# Altium schematic sheet CAN_IFC.SchDoc
size A4
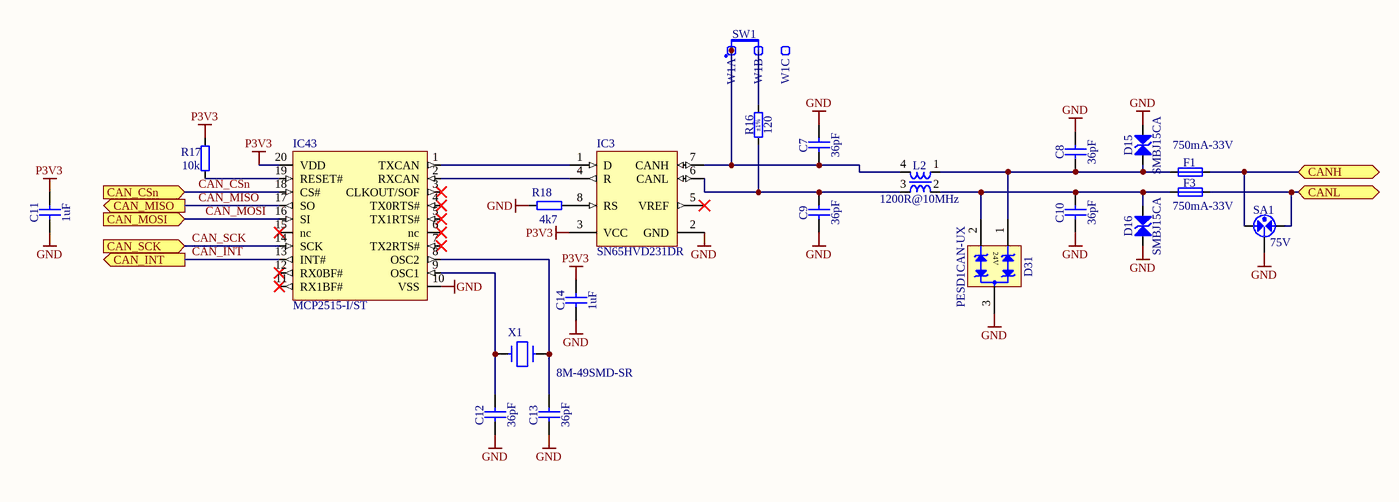
[diagram p0: CAN_IFC.SchDoc]

## Parts
C7  36pF  [CAPC1608X87N]
C8  36pF  [CAPC1608X87N]
C9  36pF  [CAPC1608X87N]
C10  36pF  [CAPC1608X87N]
C11  1uF  [CAPC1608X87N]
C12  36pF  [CAPC1608X87N]
C13  36pF  [CAPC1608X87N]
C14  1uF  [CAPC1608X87N]
D15  SMBJ15CA  [DIOM5336X265N]
D16  SMBJ15CA  [DIOM5336X265N]
D31  PESD1CAN-UX  [SOT95P237X112-3N]
F1  750mA-33V  [FUSRC4632X150N]
F3  750mA-33V  [FUSRC4632X150N]
IC3  SN65HVD231DR  [D0008A_L]
IC43  MCP2515-I/ST  [SOP65P640X110-20N]
L2  1200R@10MHz  [IND_TDK_ACT45B]
R16  120  Tolerance: ±1%  [RESC3216X65N]
R17  10k  [RESC1608X55N]
R18  4k7  [RESC1608X55N]
SA1  75V  [SAR_BOURNS_2036-xx-SM]
SW1  Jumper Type1  [JUMPER_BLACK_INSULATED_2.54MM]  (value not drawn)
W1  Test Point  [COMATEL_385.0358.1.03.400]  (value not drawn)  (parts A,B,C of 3)
X1  8M-49SMD-SR  [HC-49SM]

## Ports
CAN_CSn (in), CAN_INT (out), CAN_MISO (out), CAN_MOSI (in), CAN_SCK (in), CANH (bidir), CANL (bidir)

## Nets
GND: C7.2 C8.2 C9.1 C10.1 C11.1 C12.1 C13.1 C14.1 D15.2 D16.1 D31.3(GND) IC3.2(GND) IC43.10(VSS) R18.2 SA1.3
P3V3: C11.2 C14.2 IC3.3(VCC) IC43.20(VDD) R17.2
CAN_CSn: IC43.18(CS#) ; port CAN_CSn
CAN_INT: IC43.13(INT#) ; port CAN_INT
CAN_MISO: IC43.17(SO) ; port CAN_MISO
CAN_MOSI: IC43.16(SI) ; port CAN_MOSI
CAN_SCK: IC43.14(SCK) ; port CAN_SCK
CANH: F1.2 SA1.1 ; port CANH
CANL: F3.2 SA1.2 ; port CANL
NetC7_1: C7.1 IC3.7(CANH) L2.4 SW1.1 W1.1
NetC8_1: C8.1 D15.1 D31.1(I/O1) F1.1 L2.1
NetC9_2: C9.2 IC3.6(CANL) L2.3 R16.1
NetC10_2: C10.2 D16.2 D31.2(I/O2) F3.1 L2.2
NetC12_2: C12.2 IC43.9(OSC1) X1.1
NetC13_2: C13.2 IC43.8(OSC2) X1.2
NetIC3_1: IC3.1(D) IC43.1(TXCAN)
NetIC3_4: IC3.4(R) IC43.2(RXCAN)
NetIC3_8: IC3.8(RS) R18.1
NetIC43_19: IC43.19(RESET#) R17.1
NetR16_2: R16.2 W1.2

Not connected (* = marked no-connect by the designer): IC3 5(VREF)*; IC43 3(CLKOUT/SOF)* 4(TX0RTS#)* 5(TX1RTS#)* 6(nc)* 7(TX2RTS#)* 11(RX1BF#)* 12(RX0BF#)* 15(nc)*; W1 3

## Library data of the parts
C7-C10 C12 C13 = CC0603_36PF_50V_5%_C0G: Non-polarised capacitor; Part Description: SMD Multilayer Chip Ceramic Capacitor; Manufacturer: GENERIC; Manufacturer1 Part Number: CBR06C360J5GACAUTO; Voltage: 50V; TC: C0G/NP0; Tolerance: ±5%; Part Number: CC0603_36PF_50V_5%_C0G; Component Kind: Standard; Component Type: Standard; Pin Count: 2; Value: 36pF; Status: Preferred; Manufacturer Part Number: CC0603_36PF_50V_5%_C0G; Case: 0603; Mounted: Yes; Socket: No; SMD: Yes; Sense: No; Manufacturer1 Example: KEMET; Manufacturer1 ComponentHeight: 0.87mm; HelpURL: \\cern.ch\dfs\Applications\Altium\Datasheets\CC0603_C0G_KEMET_HiQ-CBR(Automotive).pdf; Author: CERN DEM HF; CreateDate: 03.11.2022; LatestRevisionDate: 03.11.2022
C11 C14 = CC0603_1UF_25V_10%_X7R: Non-polarised capacitor; Part Description: SMD Multilayer Chip Ceramic Capacitor; Manufacturer: GENERIC; Manufacturer1 Part Number: GRM188R71E105KA12D; Voltage: 25V; TC: X7R; Tolerance: ±10%; Part Number: CC0603_1UF_25V_10%_X7R; Component Kind: Standard; Component Type: Standard; Pin Count: 2; Value: 1uF; Status: None; Manufacturer Part Number: CC0603_1UF_25V_10%_X7R; Case: 0603; Mounted: Yes; Socket: No; SMD: Yes; Sense: No; Manufacturer1 Example: MURATA; Manufacturer1 ComponentHeight: 0.9mm; HelpURL: \\cern.ch\dfs\Applications\Altium\Datasheets\CC0603_X7R_MURATA.pdf; Author: CERN DEM JLC; CreateDate: 2011-01-18; LatestRevisionDate: 2011-01-18
D15 D16 = SMBJ15CA: Transient Voltage Suppressor Diode (Bi-Directional); Part Description: Bi-Directional Transient Voltage Suppressor Diode; Manufacturer: FAIRCHILD SEMICONDUCTOR; Voltage: 15V; Power: 600W; PressFit: No; Bonding: No; Part Number: SMBJ15CA; Component Kind: Standard; Component Type: Standard; Device: SMBJ15CA; PackageDescription: DO-214-AA/SMB Diode, Molded Body; 5.34mm L X 3.625mm W X 2.65mm H, IPC Medium Density; Manufacturer Part Number: SMBJ15CA; Pin Count: 2; Case: DO-214AA; Mounted: Yes; Socket: No; SMD: Yes; Sense: No; ComponentHeight: 2.65mm; HelpURL: \\cern.ch\dfs\Applications\Altium\Datasheets\SMBJ.pdf; Author: CERN DEM JLC; CreateDate: 06.05.2008; LatestRevisionDate: 19.12.2011
D31 = D_TVS_PESD1CAN: TVS Diode for CAN; Manufacturer: Nexperia; Voltage: 24V; Power: 400W; PressFit: No; Bonding: No; Part Number: PESD1CAN-UX; Component Kind: Standard; Component Type: Standard; Device: PESD1CAN-UX; PackageDescription: SOT, 0.95mm, pitch; 3 pin,1.30mm W X 2.92mm L X 1.12mm H body, IPC Medium Density; Part Description: TVS Diode for CAN; Manufacturer Part Number: PESD1CAN-UX; Pin Count: 3; Case: SOT-23; Mounted: Yes; Socket: No; SMD: Yes; Sense: No; ComponentHeight: 1.12mm; HelpURL: \\cern.ch\dfs\Applications\Altium\Datasheets\SM712.TCT.pdf; Author: CERN DEM JLC; CreateDate: 03.09.2014; LatestRevisionDate: 13.01.2015
F1 F3 = FUSR1812_LITTELFUSE_miniSMDC075F/33: Fuse; Part Description: PolySwitch® PTC Overcurrent Protection Device; PressFit: No; Part Number: FUSR1812_LITTELFUSE_miniSMDC075F/33; Component Kind: Standard; Component Type: Standard; Pin Count: 2; PackageDescription: Chip Resettable Fuse, 2-Leads, Body 4.6x3.2mm, IPC Medium Density; Family: Fuses Resettable; Mounted: Yes; Socket: No; SMD: Yes; Sense: No; Value: 750mA-33V; Manufacturer: LITTELFUSE; Manufacturer Part Number: miniSMDC075F/33; ComponentHeight: 1.46mm; HelpURL: \\cern.ch\dfs\Applications\Altium\Datasheets\FUSR_LITTELFUSE_MINISMD.pdf; Author: CERN DEM HF; CreateDate: 22.02.2023; LatestRevisionDate: 22.02.2023
IC3 = CMP-0315-00078-2: 3.3V CAN Transceiver with Sleep Mode, 17 mA, 3.3 V, -40 to 85 degC, 8-pin SOIC (D), Green (RoHS & no Sb/Br); Manufacturer: Texas Instruments; Drivers Per Package: 1; Transient Pulse Protection(V): -25 to 25; Supply Voltage(s)(V): 3.3; ICC(Max)(mA): 17; Rating: Catalog; PackageVersion: revM, Jun-2011; Footprint: PCA82C250; Isolated: No; PartNumber: SN65HVD231DR; Low Power Mode: Sleep; ComponentLink1Description: Datasheet; DatasheetVersion: SLOS346K; PackageReference: D0008A; SubFamily: CAN; Eco-Plan: Green (RoHS & no Sb/Br); Features: Bus Wake Up; Code_JEDEC: MS-012AA; Receivers Per Package: 1; PackageDescription: 8-Pin Plastic Small Outline Integrated Circuit, 4.9 x 3.9 mm, Pitch 1.27 mm Pitch; Mounting Technology: Surface Mount; ComponentLink1URL: http://www.ti.com/general/docs/lit/getliterature.tsp?genericPartNumber=SN65HVD231&fileType=pdf
IC43 = IFC_MCP2515_TSSOP: CAN Controller With SPI nterface; Manufacturer: Microchip; Manufacturer Part Number: MCP2515T-I/ST; Part Description: Stand-Alone CAN Controller with SPI Interface; Case: TSSOP20; Component Type: Standard; Device: MCP2515; Mounted: Yes; PackageDescription: TSSOP 20, Pitch 0.65mm - Body 4.5x6.5mm, IPC Medium Density; Part Number: MCP2515T-I/ST; Pin Count: 20; SMD: Yes
L2 = IND_TDK_ACT45B-220-2P: Inductor Common Mode; Part Description: Common Mode Filters For Automotive Signal Line, TDK ACT Series; Manufacturer: TDK; Manufacturer Part Number: ACM45B-220-2P; Power: 200mA; Resistance: 1R; Part Number: IND_TDK_ACT45B-220-2P; Component Kind: Standard; Component Type: Standard; Pin Count: 2; Value: 1200R@10MHz; Mounted: Yes; Socket: No; SMD: Yes; Sense: No; ComponentHeight: 3mm; HelpURL: \\cern.ch\dfs\Applications\Altium\Datasheets\IND_TDK_ACT45B.pdf; Author: CERN DEM BC; CreateDate: 09.04.2020; LatestRevisionDate: 09.04.2020
R16 = R1206_120R_1%_0.25W_100PPM: Resistor - 1%; Part Description: General Purpose Thick Film Chip Resistor; Manufacturer: GENERIC; Manufacturer1 Part Number: NRC12F1200TRF; Power: 0.25W; TC: ±100ppm/°C; PressFit: No; Part Number: R1206_120R_1%_0.25W_100PPM; Component Kind: Standard; Component Type: Standard; Pin Count: 2; Value: 120; Status: Preferred; Manufacturer Part Number: R1206_120R_1%_0.25W_100PPM; Case: 1206; Mounted: Yes; Sense: No; Socket: No; SMD: Yes; Manufacturer1 Example: NIC COMPONENT; Manufacturer1 ComponentHeight: 0.65mm; HelpURL: \\cern.ch\dfs\Applications\Altium\Datasheets\R1206_NIC_NRC.pdf; Author: CERN DEM JLC; CreateDate: 03.12.2007; LatestRevisionDate: 13.03.2008
R17 = R0603_10K_1%_0.1W_100PPM: Resistor - 1%; Part Description: General Purpose Thick Film Chip Resistor; Manufacturer: GENERIC; Manufacturer1 Part Number: NRC06F1002TRF; Power: 0.1W; TC: ±100ppm/°C; PressFit: No; Part Number: R0603_10K_1%_0.1W_100PPM; Component Kind: Standard; Component Type: Standard; Pin Count: 2; Value: 10k; Status: Preferred; Tolerance: ±1%; Manufacturer Part Number: R0603_10K_1%_0.1W_100PPM; Case: 0603; Mounted: Yes; Sense: No; Socket: No; SMD: Yes; Manufacturer1 Example: NIC COMPONENT; Manufacturer1 ComponentHeight: 0.55mm; HelpURL: \\cern.ch\dfs\Applications\Altium\Datasheets\R0603_NIC_NRC.pdf; Author: CERN DEM JLC; CreateDate: 03.12.2007; LatestRevisionDate: 13.03.2008
R18 = R0603_4K7_1%_0.1W_100PPM: Resistor - 1%; Part Description: General Purpose Thick Film Chip Resistor; Manufacturer: GENERIC; Manufacturer1 Part Number: NRC06F4701TRF; Power: 0.1W; TC: ±100ppm/°C; PressFit: No; Part Number: R0603_4K7_1%_0.1W_100PPM; Component Kind: Standard; Component Type: Standard; Pin Count: 2; Value: 4k7; Status: Preferred; Tolerance: ±1%; Manufacturer Part Number: R0603_4K7_1%_0.1W_100PPM; Case: 0603; Mounted: Yes; Sense: No; Socket: No; SMD: Yes; Manufacturer1 Example: NIC COMPONENT; Manufacturer1 ComponentHeight: 0.55mm; HelpURL: \\cern.ch\dfs\Applications\Altium\Datasheets\R0603_NIC_NRC.pdf; Author: CERN DEM JLC; CreateDate: 03.12.2007; LatestRevisionDate: 13.03.2008
SA1 = SAR_BOURNS_2036-07-SMLF: Surge Arrester; Part Description: 3-electrode Precision Gas Discharge Tube Surge Protector 2036-xx-SM Series; Manufacturer: BOURNS; PressFit: No; Part Number: SAR_BOURNS_2036-07-SMLF; Component Kind: Standard; Component Type: Standard; Pin Count: 3; PackageDescription: 3-electrode Precision Gas Discharge Tube Surge Protector Body D5 mm x L7.3 mm; Family: Surge Arrester; Mounted: Yes; Socket: No; SMD: Yes; Sense: No; Value: 75V; Manufacturer Part Number: 2036-07-SMLF; ComponentHeight: 5mm; HelpURL: \\cern.ch\dfs\Applications\Altium\Datasheets\SAR_BOURNS_2036-xx-SM.pdf; Author: CERN DEM JLC; CreateDate: 06.04.2011; LatestRevisionDate: 06.04.2011
SW1 = COMATEL_313.1730.0.00.40.0: Jumper 1 Pin; Part Description: Closed Insulated Black Jumper Pitch 2.54mm; Manufacturer: KONTEK COMATEL; PressFit: No; SCEM: 09.55.10.960.9; Part Number: COMATEL_313.1730.0.00.40.0; Component Kind: Accessories; Component Type: Standard; Pin Count: 1; Family: Jumper; Mounted: Yes; Socket: No; SMD: No; Sense: No; Status: Obsolete; Manufacturer Part Number: 313.1730.0.00.40.0; ComponentHeight: 6.5mm; HelpURL: \\cern.ch\dfs\Applications\Altium\Datasheets\COMATEL_313.1730.0.00.40.0.pdf; Author: CERN DEM JLC; CreateDate: 09.04.2008; LatestRevisionDate: 27.08.2013
W1 = COMATEL_385.0358.1.03.400: 3 Mini Wire-Wrap Contact Strip Header; Part Description: 3 Contacts Straight Strip Header Pitch 2.54mm L=6.3mm ''Mini-Wire-Wrap''; Manufacturer: KONTEK COMATEL; PressFit: No; Part Number: COMATEL_385.0358.1.03.400; Component Kind: Standard; Component Type: Standard; Pin Count: 3; Family: Test Point; Mounted: Yes; Socket: No; SMD: No; Sense: No; Status: Not recommended; Manufacturer Part Number: 385.0358.1.03.400; ComponentHeight: 8mm; HelpURL: \\cern.ch\dfs\Applications\Altium\Datasheets\COMATEL_385.0358.1.03.400.pdf; Author: CERN DEM JLC; CreateDate: 30.06.2010; LatestRevisionDate: 10.10.2012
X1 = X_CRYSTAL_HC49_SMT: 8MHz; ±30ppm; 20pF; SMD; HC49SMD; Supplier 1: Newark; Supplier Part Number 1: 56P2843